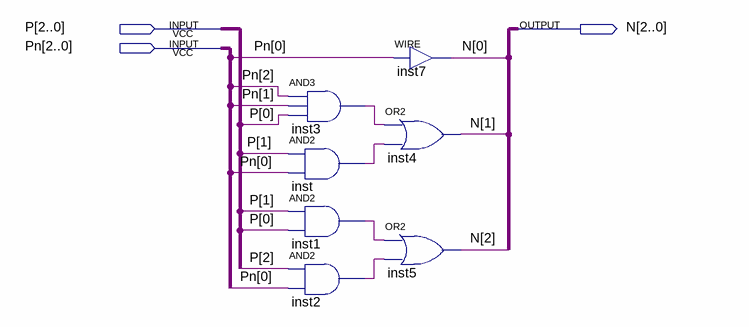
[diagram p0: schematic sheet]
// Quartus schematic NextState.bdf as structural Verilog: 7 symbols, 3 pins
module NextState (
  input  [2:0] P,
  input  [2:0] Pn,
  output [2:0] N
);

  wire inst1_out, inst2_out, inst3_out, inst_out;

  and inst3 (inst3_out, Pn[2], Pn[1], P[0]);
  and inst (inst_out, P[1], Pn[0]);
  and inst1 (inst1_out, P[1], P[0]);
  and inst2 (inst2_out, P[2], Pn[0]);
  assign N[0] = Pn[0];  // WIRE inst7
  or inst4 (N[1], inst3_out, inst_out);
  or inst5 (N[2], inst1_out, inst2_out);
endmodule
